# Altium schematic sheet Balancer.SchDoc
size A4; SheetNumber: 2; SheetTotal: 2
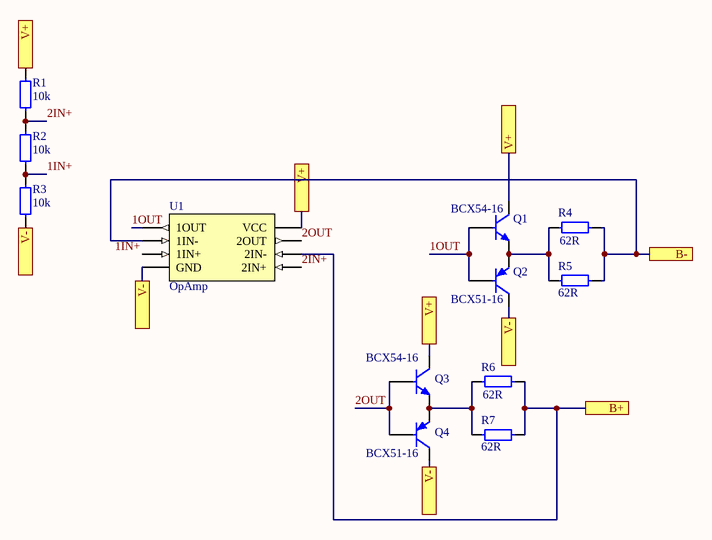
[diagram p0: Balancer.SchDoc]

## Parts
Q1  BCX54-16  [SOT-89]
Q2  BCX51-16  [SOT-89]
Q3  BCX54-16  [SOT-89]
Q4  BCX51-16  [SOT-89]
R1  10k  [0805 Resistor]
R2  10k  [0805 Resistor]
R3  10k  [0805 Resistor]
R4  62R  [2512 Resistor]
R5  62R  [2512 Resistor]
R6  62R  [2512 Resistor]
R7  62R  [2512 Resistor]
U1  OpAmp  [SOIC-8]

## Ports
B+, B-, V+, V-

## Nets
1IN+: R2.1 R3.2 U1.3(1IN+)
1OUT: Q1.1 Q2.1 U1.1(1OUT)
2IN+: R1.1 R2.2 U1.5(2IN+)
2OUT: Q3.1 Q4.1 U1.7(2OUT)
B+: R6.2 R7.2 U1.6(2IN-) ; port B+
B-: R4.2 R5.2 U1.2(1IN-) ; port B-
V+: Q1.3 Q3.3 R1.2 U1.8(VCC) ; port V+
V-: Q2.3 Q4.3 R3.1 U1.4(GND) ; port V-
NetQ1_2: Q1.2 Q2.2 R4.1 R5.1
NetQ3_2: Q3.2 Q4.2 R6.1 R7.1

## Library data of the parts
Q1 Q3 = NPN [BC817]: NPN general-purpose transistors; Part Number: BC817-40,215; Manufacturer: Nexperia; Type: Transistor; ComponentLink1Description: DataSheet; ComponentLink1URL: https://static.chipdip.ru/lib/156/DOC000156781.pdf; ComponentLink2Description: Chip&Dip; ComponentLink2URL: https://www.chipdip.ru/product/bc817-40
Q2 Q4 = PNP [BC807]: PNP general-purpose transistors; Part Number: BC807,215; Manufacturer: Nexperia; Type: Transistor; ComponentLink1Description: DataSheet; ComponentLink1URL: https://static.chipdip.ru/lib/078/DOC001078227.pdf; ComponentLink2Description: Chip&Dip; ComponentLink2URL: https://www.chipdip.ru/product/bc807.215
R1-R3 = Res 10k (0805): 0.125W 0805 10k, 1%; Part Number: RC0805FR-0710KL; Manufacturer: Taiwan; Type: Resistor; ComponentLink1Description: Chip&Dip; ComponentLink1URL: https://www.chipdip.ru/product0/9000079514
R4-R7 = Res 62R (2512): 1W 2512 62R, 1%; Part Number: RC2512FR-0762RL; Manufacturer: Taiwan; Type: Resistor; ComponentLink1Description: Chip&Dip; ComponentLink1URL: https://www.chipdip.ru/product0/9000190086
U1 = OpAmp [LMV358]: Low Voltage Operational Amplifiers; Part Number: LMV358IDR; Manufacturer: Texas Instruments; ComponentLink1Description: DataSheet; ComponentLink1URL: https://static.chipdip.ru/lib/321/DOC000321492.pdf; ComponentLink2Description: Chip&Dip; ComponentLink2URL: https://www.chipdip.ru/product/lmv358idr-pbf; Type: IC